# Altium project 驱动侧按按键板.PrjPcb
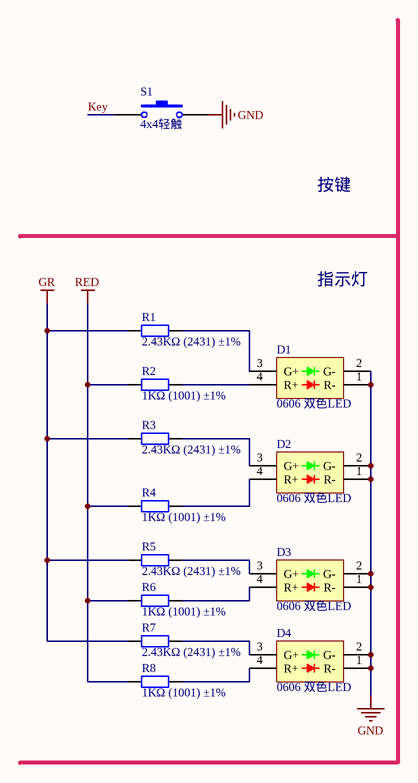
[diagram p0: main.SchDoc]
1 sheet, 13 parts. Net scope: global (net labels, ports and power ports of the same name join across sheets).
Board file: PCB3.PcbDoc

## Sheet main.SchDoc
size A4

### Parts
D1  0606 双色LED  [LED-SMD_4P-L1.6-W1.5-TL-1]
D2  0606 双色LED  [LED-SMD_4P-L1.6-W1.5-TL-1]
D3  0606 双色LED  [LED-SMD_4P-L1.6-W1.5-TL-1]
D4  0606 双色LED  [LED-SMD_4P-L1.6-W1.5-TL-1]
R1  2.43KΩ (2431) ±1%  [0402_R]
R2  1KΩ (1001) ±1%  [0402_R]
R3  2.43KΩ (2431) ±1%  [0402_R]
R4  1KΩ (1001) ±1%  [0402_R]
R5  2.43KΩ (2431) ±1%  [0402_R]
R6  1KΩ (1001) ±1%  [0402_R]
R7  2.43KΩ (2431) ±1%  [0402_R]
R8  1KΩ (1001) ±1%  [0402_R]
S1  4x4轻触  [SW-SMD_4P-L5.2-W5.2-P3.70-LS6.4]

### Nets
GND: D1.1(R-) D1.2(G-) D2.1(R-) D2.2(G-) D3.1(R-) D3.2(G-) D4.1(R-) D4.2(G-) S1.2
GR: R1.1 R3.1 R5.1 R7.1
RED: R2.1 R4.1 R6.1 R8.1
Key: S1.1
NetD1_3: D1.3(G+) R1.2
NetD1_4: D1.4(R+) R2.2
NetD2_3: D2.3(G+) R3.2
NetD2_4: D2.4(R+) R4.2
NetD3_3: D3.3(G+) R5.2
NetD3_4: D3.4(R+) R6.2
NetD4_3: D4.3(G+) R7.2
NetD4_4: D4.4(R+) R8.2

### Notes on the sheet
- 按键
- 指示灯

### Library data of the parts
D1-D4 = 0606DualColor LED: 0606 双色LED 红色/翠绿
R1 R3 R5 R7 = 0402 2KΩ (2001) 1%: 贴片电阻; ComponentLink1Description: 供应商链接; ComponentLink1URL: http://www.szlcsc.com/product/details_4516.html; Package: 0402; Supplier: LC
  R1 R3: SuppliersPartNumber: C????????
  R5: SuppliersPartNumber: C?????????
  R7: SuppliersPartNumber: C??????????
R2 R4 R6 R8 = 0402 1KΩ (1001) 1%: 贴片电阻; ComponentLink1Description: 供应商链接; ComponentLink1URL: http://www.szlcsc.com/product/details_12256.html; Package: 0402; Supplier: LC; SuppliersPartNumber: C11702
S1 = SW-PB: Switch; pin to pad: 2>3; Published: 24-Mar-1999; LatestRevisionDate: 17-Jul-2002; LatestRevisionNote: Re-released for DXP Platform.; PackageReference: SPST-2; Publisher: Altium Limited; PackageDescription: Switch; 2 Leads